# Altium schematic sheet Sheet2.SchDoc: Power Supply and Serial Communications
size A4; Date: 2020-09-14; DrawnBy: Gaurav Daura; SheetNumber: 2; SheetTotal: 2
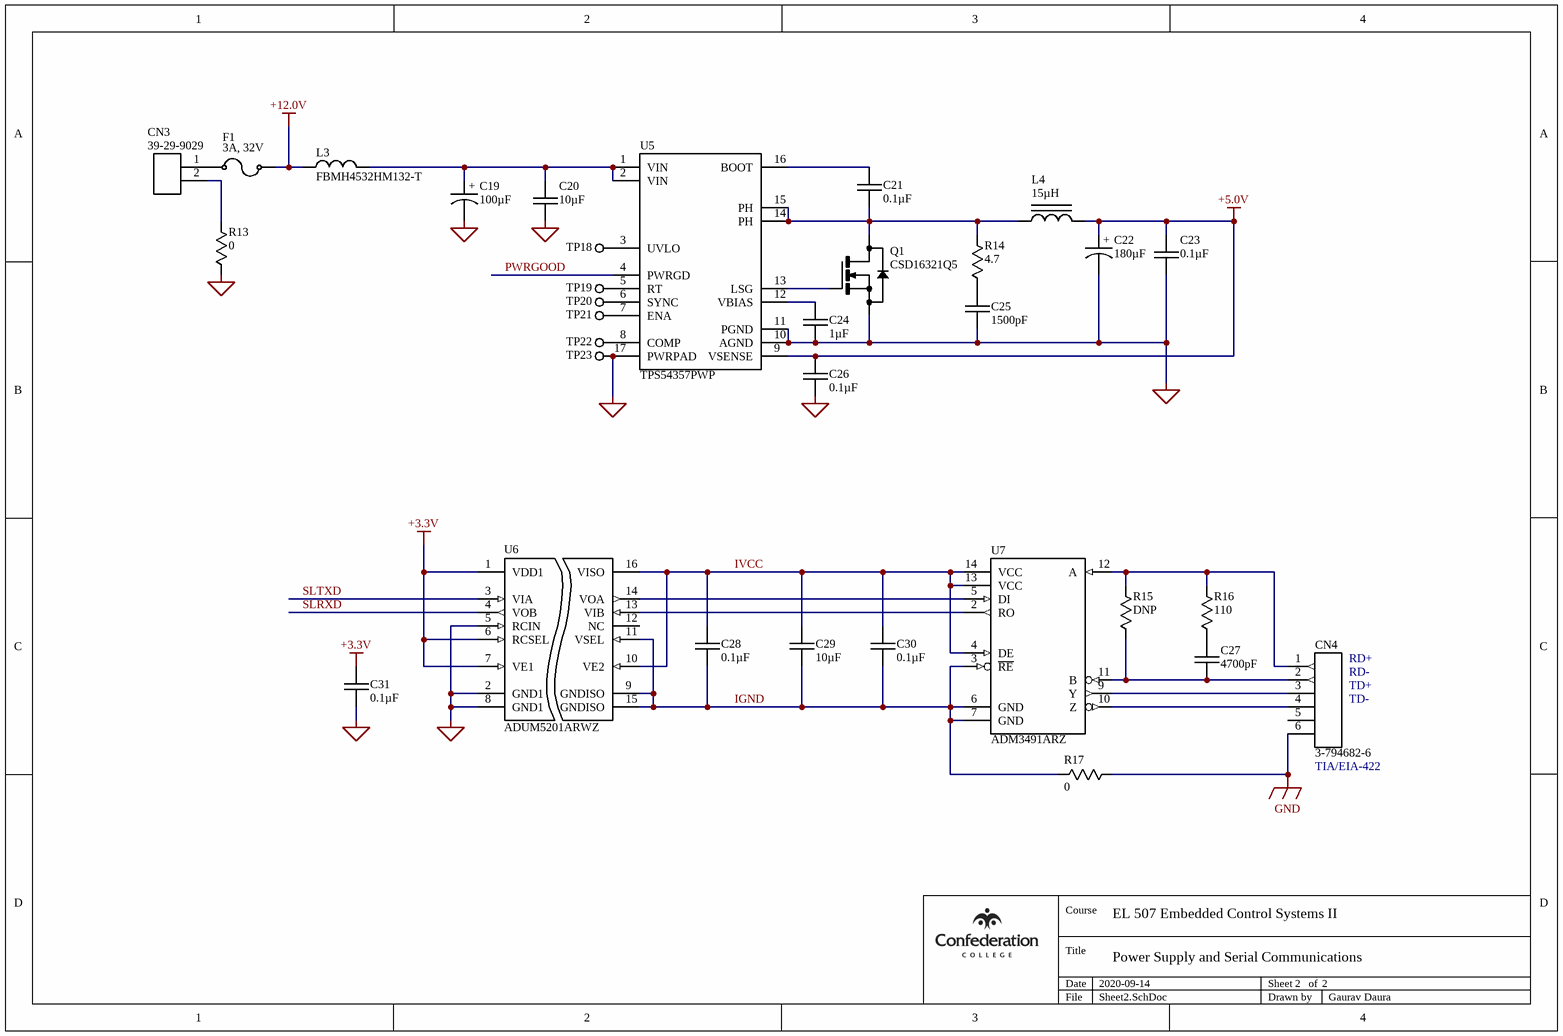
[diagram p0: Sheet2.SchDoc]

## Parts
C19  100µF  [CAPAE660X770N]
C20  10µF  [CAPC3225X250N]
C21  0.1µF  [CAPC2012X125N]
C22  180µF  [CAPMP7343X190N]
C23  0.1µF  [CAPC2012X125N]
C24  1µF  [CAPC2012X135N]
C25  1500pF  [CAPC2012X100N]
C26  0.1µF  [CAPC2012X125N]
C27  4700pF  [CAPC2012X78N]
C28  0.1µF  [CAPC2012X125N]
C29  10µF  [CAPC3225X250N]
C30  0.1µF  [CAPC2012X125N]
C31  0.1µF  [CAPC2012X125N]
CN3  39-29-9029  [MOLEX_39-29-9029]
CN4  3-794682-6  [TYCO_3-794682-6]
F1  3A, 32V  [FUSE_0468XXX.NR]
L3  FBMH4532HM132-T  [INDC4532X350N]
L4  15µH  [IND_SRU1038-150Y]
Q1  CSD16321Q5  [TI_CSD16321Q5]
R13  0  [RESC3216X60N]
R14  4.7  [RESC2012X60N]
R15  DNP  [RESC2012X60N]  (no BOM)
R16  110  [RESC2012X60N]
R17  0  [RESC3216X60N]
TP18  TESTPOINT100  [TP100]  (value not drawn)  (no BOM)
TP19  TESTPOINT100  [TP100]  (value not drawn)  (no BOM)
TP20  TESTPOINT100  [TP100]  (value not drawn)  (no BOM)
TP21  TESTPOINT100  [TP100]  (value not drawn)  (no BOM)
TP22  TESTPOINT100  [TP100]  (value not drawn)  (no BOM)
TP23  TESTPOINT100  [TP100]  (value not drawn)  (no BOM)
U5  TPS54357PWP  [SOP65P640X120-17AN]
U6  ADUM5201ARWZ  [SOIC127P1030X265-16N]
U7  ADM3491ARZ  [SOIC127P600X175-14N]

## Nets
+3.3V: C31.1 U6.1(VDD1) U6.6(RCSEL) U6.7(VE1)
+5.0V: C22.1 C23.1 C26.1 L4.2 U5.9(VSENSE)
+12.0V: F1.2 L3.1
GND: C19.2 C20.2 C22.2 C23.2 C24.2 C25.2 C26.2 C31.2 CN4.6 Q1.S R13.1 R17.2 TP23.1 U5.10(AGND) U5.11(PGND) U5.17(PWRPAD) U6.2(GND1) U6.5(RCIN) U6.8(GND1)
IGND: C28.2 C29.2 C30.2 R17.1 U6.9(GNDISO) U6.11(VSEL) U6.15(GNDISO) U7.3(~{RE}) U7.6(GND) U7.7(GND)
IVCC: C28.1 C29.1 C30.1 U6.10(VE2) U6.16(VISO) U7.4(DE) U7.13(VCC) U7.14(VCC)
PWRGOOD: U5.4(PWRGD)
SLRXD: U6.4(VOB)
SLTXD: U6.3(VIA)
NetC19_1: C19.1 C20.1 L3.2 U5.1(VIN) U5.2(VIN)
NetC21_1: C21.1 U5.16(BOOT)
NetC21_2: C21.2 L4.1 Q1.D R14.2 U5.14(PH) U5.15(PH)
NetC24_1: C24.1 U5.12(VBIAS)
NetC25_1: C25.1 R14.1
NetC27_1: C27.1 R16.1
NetC27_2: C27.2 CN4.2 R15.1 U7.11(B)
NetCN3_1: CN3.1 F1.1
NetCN3_2: CN3.2 R13.2
NetCN4_1: CN4.1 R15.2 R16.2 U7.12(A)
NetCN4_3: CN4.3 U7.9(Y)
NetCN4_4: CN4.4 U7.10(Z)
NetQ1_G: Q1.G U5.13(LSG)
NetTP18_1: TP18.1 U5.3(UVLO)
NetTP19_1: TP19.1 U5.5(RT)
NetTP20_1: TP20.1 U5.6(SYNC)
NetTP21_1: TP21.1 U5.7(ENA)
NetTP22_1: TP22.1 U5.8(COMP)
NetU6_13: U6.13(VIB) U7.2(RO)
NetU6_14: U6.14(VOA) U7.5(DI)

Not connected (* = marked no-connect by the designer): CN4 5; U6 12(NC)

## Notes on the sheet
- (near CN4) RD+
- (near CN4) RD-
- (near CN4) TD+
- (near CN4) TD-
- (near CN4) TIA/EIA-422
- Course
- EL 507 Embedded Control Systems II
- Title
- Date
- Sheet
- of
- File
- Drawn by
- (in symbol EEE-1EA101XP) +
- (in symbol EEF-SE0J181R) +

## Library data of the parts
C19 = EEE-1EA101XP: 100µF/25V/20% Aluminum Electrolytic Capacitor; Manufacturer: Panasonic Corporation of North America; CRN: 12041; PartNumber: EEE-1EA101XP
C20 C29 = UMK325C7106MM-T: 10µF/50V/20% Multilayer Ceramic Chip Capacitor; Manufacturer: Taiyo Yuden; CRN: 12041; PartNumber: UMK325C7106MM-T
C21 C23 C26 C28 C30 C31 = GRM21BR71H104KA01L: 0.1µF/50V/±10% X7R Ceramic Chip Capacitor; Manufacturer: Murata Manufacturing Co., Ltd.; CRN: 12041; PartNumber: GRM21BR71H104KA01L
C22 = EEF-SE0J181R: 180µF/6.3V/20% Low ESR Polymer Aluminum Capacitor (SP-CAP); Manufacturer: Panasonic Corporation of North America; CRN: 12041; PartNumber: EEF-SE0J181R
C24 = CL21B105KBFNNNE: 1µF/50V 10% X7R Multi-Layer Ceramic Capacitor; Manufacturer: Samsung Electro-Mechanics; CRN: 12041; PartNumber: CL21B105KBFNNNE
C25 = GRM21AR72E152KW01D: 1500pF/250V/±10% X7R Ceramic Chip Capacitor; Manufacturer: Murata Manufacturing Co., Ltd.; CRN: 12041; PartNumber: GRM21AR72E152KW01D
C27 = C0805C472K5RACTU: 4700pF/50V/10% Ceramic Capacitor; Manufacturer: Kemet Electronics Corporation; CRN: 12041; PartNumber: C0805C472K5RACTU
CN3 = 39-29-9029: Mini-Fit Jr. Header, Dual Row, Vertical, with Snap-in Plastic Peg PCB Lock, 2 Circuits, PA Polyamide Nylon 6/6 94V-2, 0.76µm Gold (Au) Plating; Manufacturer: Molex Inc.; CRN: 12041; PartNumber: 39-29-9029
CN4 = 3-794682-6: 6 Circuit, Micro MATE-N-LOK 3 mm Vertical Connector; Manufacturer: Tyco Electronics Corporation; CRN: 12041; PartNumber: 3-794682-6
F1 = 0468003.NR: 1 A, 32 V, Slo-Blo, 468 Series Surface Mount Fuse; Manufacturer: Littelfuse, Inc.; CRN: 12041; PartNumber: 0468003.NR
L3 = FBMH4532HM132-T: Multilayer SMD Ferrite Bead, 3A, 1.3k @ 100 MHz; Manufacturer: Taiyo Yuden; CRN: 12041; PartNumber: FBMH4532HM132-T
L4 = SRU1038-150Y: 15µH Shielded SMD Power Inductor; Manufacturer: Bourns, Inc.; CRN: 12041; PartNumber: SRU1038-150Y
Q1 = CSD16321Q5: 25V, 31 A, N-Channel Power MOSFET; Manufacturer: Texas Instruments, Inc.; CRN: 12041; PartNumber: CSD16321Q5
R13 R17 = ERJ-8GEY0R00V: 0, 5%, 0.25W Thick Film Chip Resistor; Manufacturer: Panasonic Corporation of North America; CRN: 12041; PartNumber: ERJ-8GEY0R00V; Value: 0
R14 = ERJ-6GEYJ4R7V: 4.7, ±5%, 0.125W Thick Film Chip Resistor; Manufacturer: Panasonic Corporation of North America; CRN: 12041; PartNumber: ERJ-6GEYJ4R7V; Value: 4.7
R15 = DNP_RESC2012X60N: 2012 Chip Resistor; Manufacturer: Confederation College; CRN: 12041; PartNumber: -
R16 = ERJ-6ENF1100V: 110, 1%, 0.125W Precision Thick Film Chip Resistor; Manufacturer: Panasonic Corporation of North America; CRN: 12041; PartNumber: ERJ-6ENF1100V; Value: 110
TP18-TP23 = TESTPOINT100: Test Point; Manufacturer: Confederation College; CRN: 12041; PartNumber: -
U5 = TPS54357PWP: 5V, 4.5V to 20V Input, 3A Output Synchronous PWM Switcher with Integrated FET (SWIFT); Manufacturer: Texas Instruments, Inc.; CRN: 12041; PartNumber: TPS54357PWP
U6 = ADUM5201ARWZ: 1Mbps Dual Channel Digital Isolator with isoPower Integrated DC-to-DC Converter, 2.5 kV; Manufacturer: Analog Devices, Inc.; CRN: 12041; PartNumber: ADUM5201ARWZ
U7 = ADM3491ARZ: 3.3 V, Full Duplex, 840 uA, 20 Mbps, EIA RS-485 Transceiver; Manufacturer: Analog Devices, Inc.; CRN: 12041; PartNumber: ADM3491ARZ